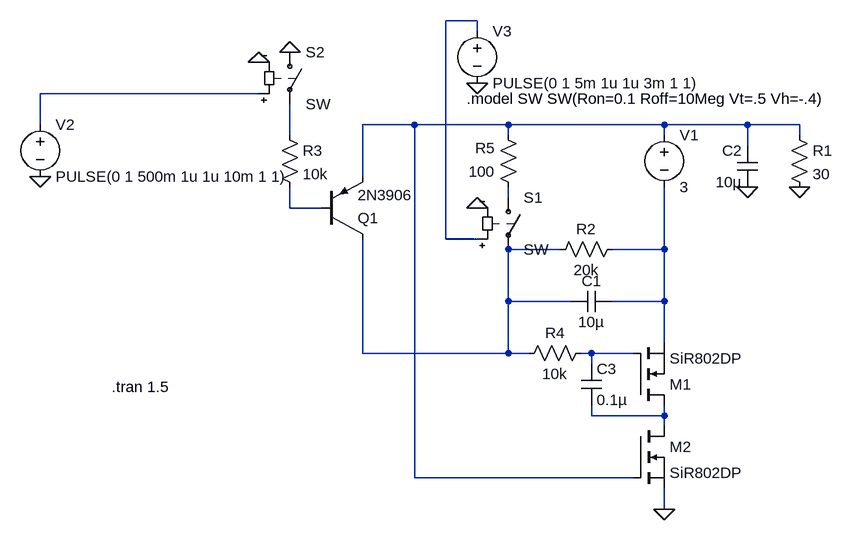
[diagram p0: schematic STMOMv4_Battery_Startup.asc]
STMOMv4_Battery_Startup.asc, the LTspice schematic file:
Version 4
SHEET 1 880 680
WIRE -32 -192 -80 -192
WIRE -32 -176 -32 -192
WIRE -368 -80 -704 -80
WIRE -704 -32 -704 -80
WIRE -128 -32 -208 -32
WIRE 16 -32 -128 -32
WIRE 256 -32 16 -32
WIRE 384 -32 256 -32
WIRE 464 -32 384 -32
WIRE -320 -16 -320 -64
WIRE 16 -16 16 -32
WIRE 256 -16 256 -32
WIRE 464 -16 464 -32
WIRE 384 0 384 -32
WIRE -208 48 -208 -32
WIRE 16 80 16 64
WIRE -320 96 -320 64
WIRE -272 96 -320 96
WIRE -80 144 -80 -192
WIRE -32 144 -80 144
WIRE 96 160 16 160
WIRE 256 160 256 64
WIRE 256 160 176 160
WIRE 16 240 16 160
WIRE 112 240 16 240
WIRE 256 240 256 160
WIRE 256 240 176 240
WIRE 256 304 256 240
WIRE -208 320 -208 144
WIRE 16 320 16 240
WIRE 16 320 -208 320
WIRE 48 320 16 320
WIRE 144 320 128 320
WIRE 208 320 144 320
WIRE 144 336 144 320
WIRE 144 416 144 400
WIRE 256 416 256 400
WIRE 256 416 144 416
WIRE 256 432 256 416
WIRE -128 512 -128 -32
WIRE 208 512 -128 512
WIRE 256 560 256 528
FLAG 256 560 0
FLAG 464 64 0
FLAG -32 -96 0
FLAG -32 96 0
FLAG -704 48 0
FLAG -368 -128 0
FLAG -320 -144 0
FLAG 384 64 0
SYMBOL nmos 208 400 M180
SYMATTR InstName M1
SYMATTR Value SiR802DP
SYMBOL voltage 256 -32 R0
SYMATTR InstName V1
SYMATTR Value 3
SYMBOL res 448 -32 R0
SYMATTR InstName R1
SYMATTR Value 30
SYMBOL sw 16 64 R0
SYMATTR InstName S1
SYMBOL res 192 144 R90
WINDOW 0 0 56 VBottom 2
WINDOW 3 32 56 VTop 2
SYMATTR InstName R2
SYMATTR Value 20k
SYMBOL cap 176 224 R90
WINDOW 0 0 32 VBottom 2
WINDOW 3 32 32 VTop 2
SYMATTR InstName C1
SYMATTR Value 10µ
SYMBOL res -336 -32 R0
SYMATTR InstName R3
SYMATTR Value 10k
SYMBOL pnp -272 144 M180
SYMATTR InstName Q1
SYMATTR Value 2N3906
SYMBOL voltage -32 -192 R0
WINDOW 123 0 0 Left 0
WINDOW 39 0 0 Left 0
SYMATTR InstName V3
SYMATTR Value PULSE(0 1 5m 1u 1u 3m 1 1)
SYMBOL sw -320 -160 R0
SYMATTR InstName S2
SYMBOL voltage -704 -48 R0
WINDOW 123 0 0 Left 0
WINDOW 39 0 0 Left 0
SYMATTR InstName V2
SYMATTR Value PULSE(0 1 500m 1u 1u 10m 1 1)
SYMBOL nmos 208 432 R0
SYMATTR InstName M2
SYMATTR Value SiR802DP
SYMBOL cap 400 64 R180
WINDOW 0 24 56 Left 2
WINDOW 3 24 8 Left 2
SYMATTR InstName C2
SYMATTR Value 10µ
SYMBOL res 144 304 R90
WINDOW 0 0 56 VBottom 2
WINDOW 3 32 56 VTop 2
SYMATTR InstName R4
SYMATTR Value 10k
SYMBOL cap 128 336 R0
SYMATTR InstName C3
SYMATTR Value 0.1µ
SYMBOL res 32 80 R180
WINDOW 0 36 76 Left 2
WINDOW 3 36 40 Left 2
SYMATTR InstName R5
SYMATTR Value 100
TEXT -48 -72 Left 2 !.model SW SW(Ron=0.1 Roff=10Meg Vt=.5 Vh=-.4)
TEXT -594 372 Left 2 !.tran 1.5

The netlist it stands for:
* STMOMv4_Battery_Startup.asc
M1 N010 N009 N008 N008 SiR802DP
V1 N003 N008 3
R1 N003 0 30
S1 N005 N007 N001 0 SW
R2 N008 N007 20k
C1 N008 N007 10µ
R3 N004 N006 10k
Q1 N007 N006 N003 0 2N3906
V3 N001 0 PULSE(0 1 5m 1u 1u 3m 1 1)
S2 0 N004 N002 0 SW
V2 N002 0 PULSE(0 1 500m 1u 1u 10m 1 1)
M2 N010 N003 0 0 SiR802DP
C2 0 N003 10µ
R4 N009 N007 10k
C3 N009 N010 0.1µ
R5 N005 N003 100
.model NPN NPN
.model PNP PNP
.lib standard.bjt
.model NMOS NMOS
.model PMOS PMOS
.lib standard.mos
.model SW SW(Ron=0.1 Roff=10Meg Vt=.5 Vh=-.4)
.tran 1.5
.backanno
.end